# Altium schematic sheet USB-NORA-W1_SCHEM_02.SchDoc
size B; Date: 7/24/2020; CompanyName: U-blox; DrawnBy: ASOH/HEKF; Engineer: ASOH/HEKF; Organization: U-blox; Address1: Östra Varvsgatan 4; Address2: SE-211 75 Malmo; DocumentNumber: 2; Revision: A; SheetNumber: 2; SheetTotal: 3; SheetSize: B; SheetTitle: Interface MCU
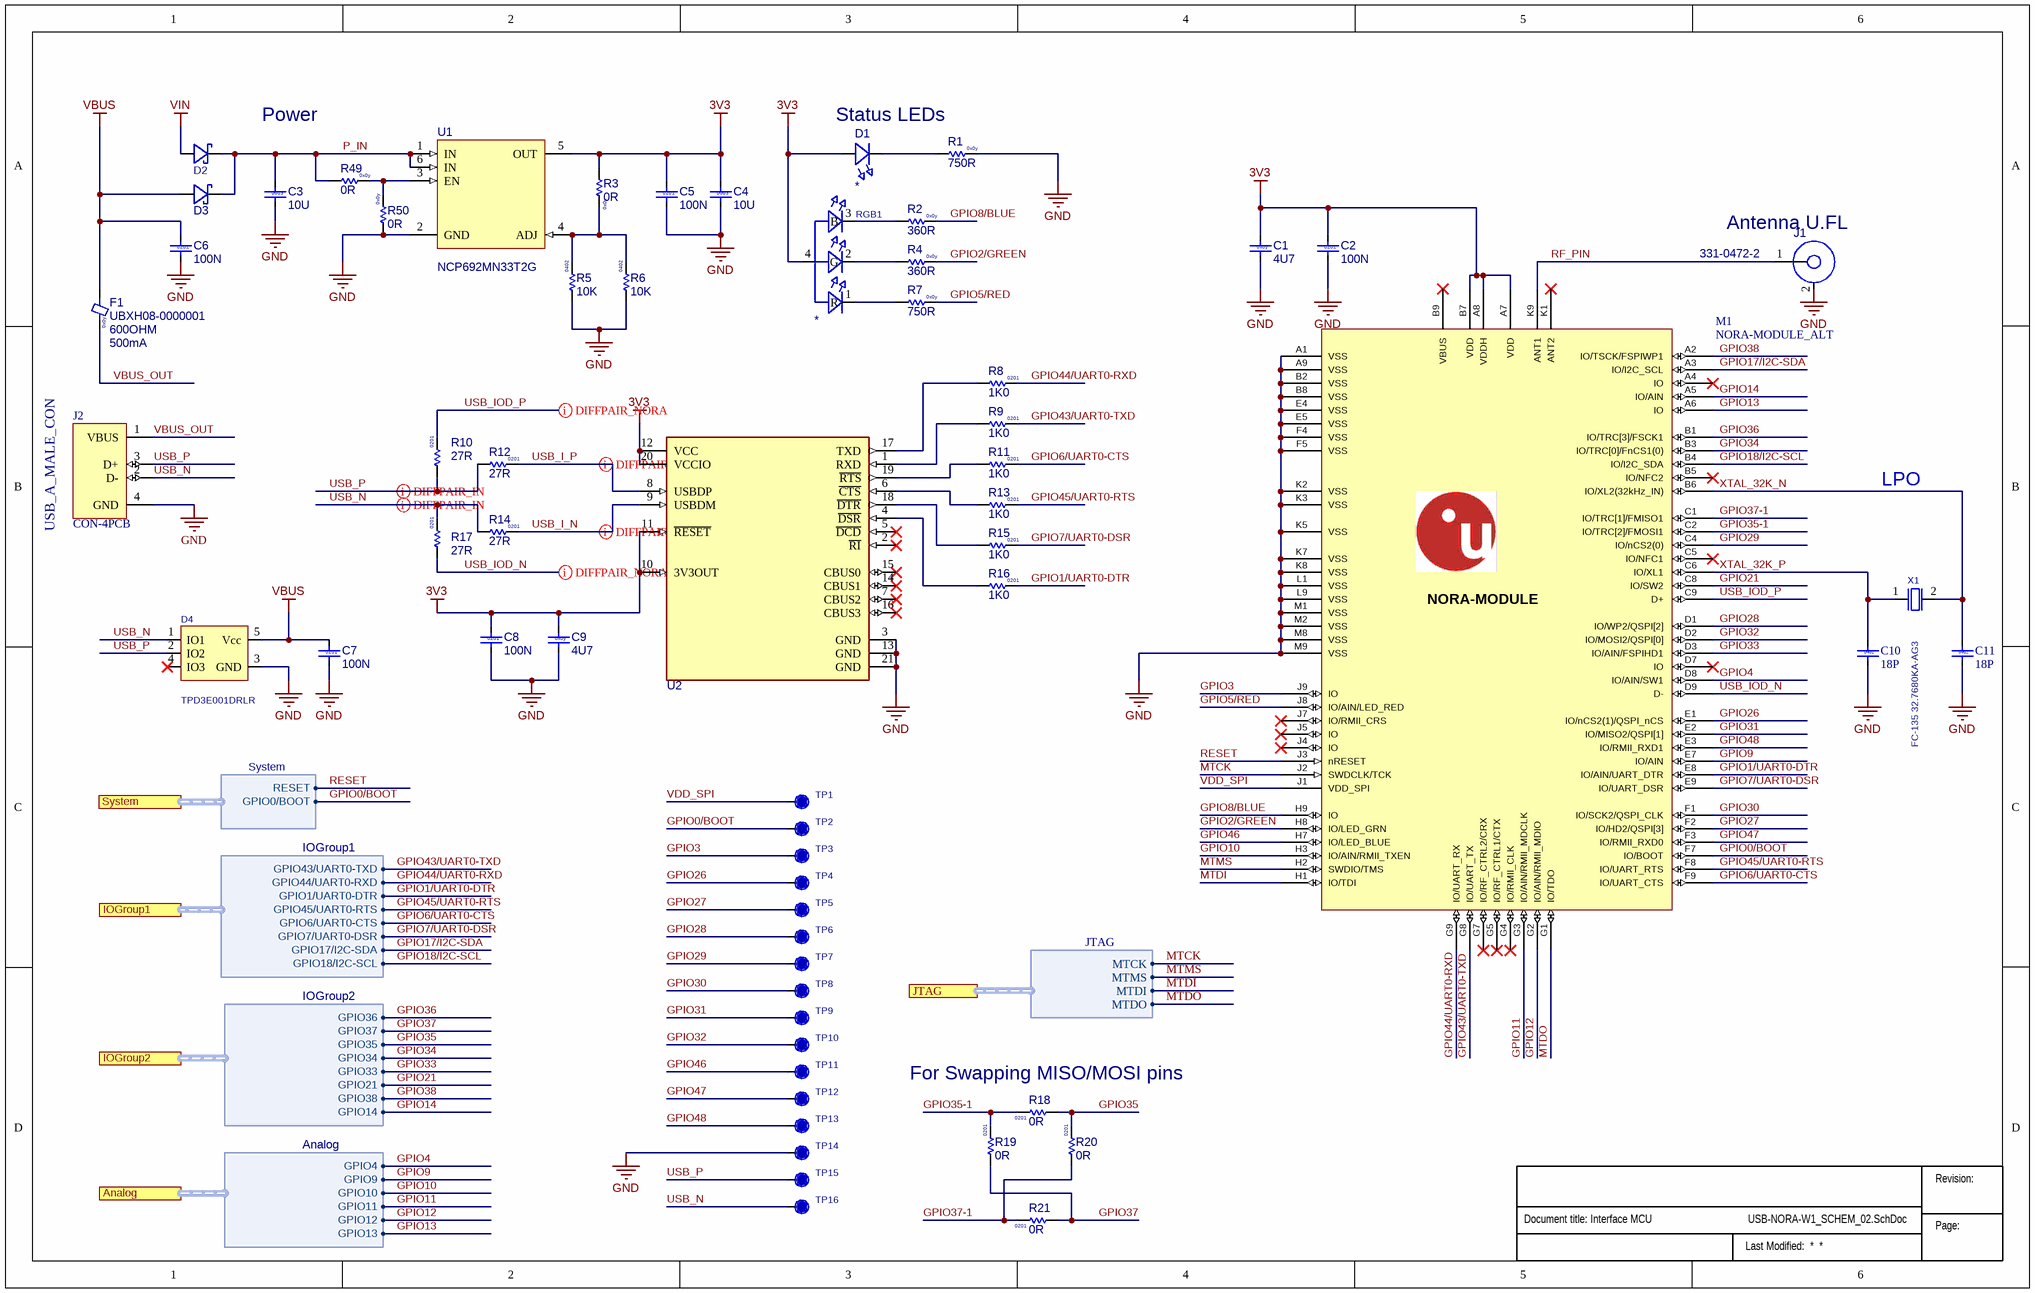
[diagram p0: USB-NORA-W1_SCHEM_02.SchDoc]

## Parts
?  (no value)  (graphical)
C1  value 4U7  Size: 0x0y  [Cap 0402 HD]
C2  value 100N  Size: 0201  [Cap 0201 HD]  (hidden comment: UBXH01-0000417100N)
C3  value 10U  Size: 0603  [Cap 0603 HD]
C4  value 10U  Size: 0603  [Cap 0603 HD]
C5  value 100N  Size: 0201  [Cap 0201 HD]
C6  value 100N  Size: 0201  [Cap 0201 HD]
C7  value 100N  Size: 0201  [Cap 0201 HD]
C8  value 100N  Size: 0201  [Cap 0201 HD]  (hidden comment: UBXH01-0000417100N)
C9  value 4U7  Size: 0x0y  [Cap 0402 HD]
C10  value 18P  Size: 0402  [Cap 0402]
C11  value 18P  Size: 0402  [Cap 0402]
D1  (no value)  [LED-0603]
D2  (no value)  [SOD-123F_U]
D3  (no value)  [SOD-123F_U]
D4  Manufacturer P/N: TPD3E001DRLR  [SOT-553]  (hidden comment: 110-00018)
F1  value 600OHM  Size: 0x0y  Part Number: UBXH08-0000001  Max Current: 500mA  [IND 0603 HD]
J1  Manufacturer P/N: 331-0472-2  [U.FL_3Pin]
J2  CON-4PCB  [USB-A-PCB]
M1  NORA-MODULE_ALT  [NORA_LGA82R_1430X1040X180_ANT]
R1  value 750R  Size: 0x0y  [RES 0402 HD]
R2  value 360R  Size: 0x0y  [RES 0402 HD]
R3  value 0R  Size: 0x0y  [RES 0402 HD]
R4  value 360R  Size: 0x0y  [RES 0402 HD]
R5  value 10K  Size: 0402  [RES 0402 HD]
R6  value 10K  Size: 0402  [RES 0402 HD]
R7  value 750R  Size: 0x0y  [RES 0402 HD]
R8  value 1K0  Size: 0201  [RES 0201 HD]
R9  value 1K0  Size: 0201  [RES 0201 HD]  (hidden comment: UBXH18-00080491K0)
R10  value 27R  Size: 0201  [RES 0201 HD]
R11  value 1K0  Size: 0201  [RES 0201 HD]  (hidden comment: UBXH18-00080491K0)
R12  value 27R  Size: 0201  [RES 0201 HD]
R13  value 1K0  Size: 0201  [RES 0201 HD]
R14  value 27R  Size: 0201  [RES 0201 HD]
R15  value 1K0  Size: 0201  [RES 0201 HD]
R16  value 1K0  Size: 0201  [RES 0201 HD]
R17  value 27R  Size: 0201  [RES 0201 HD]
R18  value 0R  Size: 0201  [RES 0201 HD]  (hidden comment: UBXH18-00030020R)
R19  value 0R  Size: 0201  [RES 0201 HD]  (hidden comment: UBXH18-00030020R)
R20  value 0R  Size: 0201  [RES 0201 HD]  (hidden comment: UBXH18-00030020R)
R21  value 0R  Size: 0201  [RES 0201 HD]  (hidden comment: UBXH18-00030020R)
R49  value 0R  Size: 0x0y  [RES 0402 HD]
R50  value 0R  Size: 0x0y  [RES 0402 HD]
RGB1  (no value)  [LED_1616]
TP1  TP  [TP10R]  (value not drawn)  (no BOM)
TP2  TP  [TP10R]  (value not drawn)  (no BOM)
TP3  TP  [TP10R]  (value not drawn)  (no BOM)
TP4  TP  [TP10R]  (value not drawn)  (no BOM)
TP5  TP  [TP10R]  (value not drawn)  (no BOM)
TP6  TP  [TP10R]  (value not drawn)  (no BOM)
TP7  TP  [TP10R]  (value not drawn)  (no BOM)
TP8  TP  [TP10R]  (value not drawn)  (no BOM)
TP9  TP  [TP10R]  (value not drawn)  (no BOM)
TP10  TP  [TP10R]  (value not drawn)  (no BOM)
TP11  TP  [TP10R]  (value not drawn)  (no BOM)
TP12  TP  [TP10R]  (value not drawn)  (no BOM)
TP13  TP  [TP10R]  (value not drawn)  (no BOM)
TP14  TP  [TP10R]  (value not drawn)  (no BOM)
TP15  TP  [TP10R]  (value not drawn)  (no BOM)
TP16  TP  [TP10R]  (value not drawn)  (no BOM)
U1  NCP692MN33T2G  [DFN-PSON.1P3X3-7pin_HS-7N]
U2  FT231XQ-R  [QFN_5x5_FT231XQ]  (value not drawn)
X1  Manufacturer P/N: FC-135 32.7680KA-AG3  [XTAL_3215]

## Ports
Analog (harness Analog, see USB-NORA-W1_TOP_01[3B], USB-NORA-W1_SCHEM_03[2B]), IOGroup1 (harness IOGroup1, see USB-NORA-W1_TOP_01[3B], USB-NORA-W1_SCHEM_03[2B]), IOGroup2 (harness IOGroup2, see USB-NORA-W1_TOP_01[3B], USB-NORA-W1_SCHEM_03[2A]), JTAG (harness JTAG, see USB-NORA-W1_TOP_01[3B], USB-NORA-W1_SCHEM_03[2A]), System (harness System, see USB-NORA-W1_TOP_01[3B], USB-NORA-W1_SCHEM_03[2C])

## Harnesses
IOGroup1: GPIO43/UART0-TXD, GPIO44/UART0-RXD, GPIO1/UART0-DTR, GPIO45/UART0-RTS, GPIO6/UART0-CTS, GPIO7/UART0-DSR, GPIO17/I2C-SDA, GPIO18/I2C-SCL
IOGroup2: GPIO36, GPIO37, GPIO35, GPIO34, GPIO33, GPIO21, GPIO38, GPIO14
Analog: GPIO4, GPIO9, GPIO10, GPIO11, GPIO12, GPIO13
System: RESET, GPIO0/BOOT
JTAG: MTCK, MTMS, MTDI, MTDO

## Nets
3V3: C1.1 C2.1 C4.1 C5.1 C8.1 C9.1 D1.2(A) M1.A7(VDD) M1.A8(VDDH) M1.B7(VDD) R3.1 RGB1.4(A) U1.5(OUT) U2.10(3V3OUT) U2.11(~{RESET}) U2.12(VCC) U2.20(VCCIO)
GND: C1.2 C2.2 C3.2 C4.2 C5.2 C6.2 C7.2 C8.2 C9.2 C10.2 C11.2 D4.3(GND) J1.2 J2.4(GND) M1.A1(VSS) M1.A9(VSS) M1.B2(VSS) M1.B8(VSS) M1.E4(VSS) M1.E5(VSS) M1.F4(VSS) M1.F5(VSS) M1.K2(VSS) M1.K3(VSS) M1.K5(VSS) M1.K7(VSS) M1.K8(VSS) M1.L1(VSS) M1.L9(VSS) M1.M1(VSS) M1.M2(VSS) M1.M8(VSS) M1.M9(VSS) R1.2 R5.1 R6.1 R50.1 TP14.1 U1.2(GND) U2.3(GND) U2.13(GND) U2.21(GND)
VBUS: C6.1 C7.1 D3.A(Anode) D4.5(Vcc) F1.1
VIN: D2.A(Anode)
GPIO0/BOOT: M1.F7(IO/BOOT) TP2.1 ; port System.GPIO0/BOOT
GPIO1/UART0-DTR: M1.E8(IO/AIN/UART_DTR) R16.2 ; port IOGroup1.GPIO1/UART0-DTR
GPIO2/GREEN: M1.H8(IO/LED_GRN) R4.2
GPIO3: M1.J9(IO) TP3.1
GPIO4: M1.D8(IO/AIN/SW1) ; port Analog.GPIO4
GPIO5/RED: M1.J8(IO/AIN/LED_RED) R7.2
GPIO6/UART0-CTS: M1.F9(IO/UART_CTS) R11.2 ; port IOGroup1.GPIO6/UART0-CTS
GPIO7/UART0-DSR: M1.E9(IO/UART_DSR) R15.2 ; port IOGroup1.GPIO7/UART0-DSR
GPIO8/BLUE: M1.H9(IO) R2.2
GPIO9: M1.E7(IO/AIN) ; port Analog.GPIO9
GPIO10: M1.H3(IO/AIN/RMII_TXEN) ; port Analog.GPIO10
GPIO11: M1.G3(IO/AIN/RMII_MDCLK) ; port Analog.GPIO11
GPIO12: M1.G2(IO/AIN/RMII_MDIO) ; port Analog.GPIO12
GPIO13: M1.A6(IO) ; port Analog.GPIO13
GPIO14: M1.A5(IO/AIN) ; port IOGroup2.GPIO14
GPIO17/I2C-SDA: M1.A3(IO/I2C_SCL) ; port IOGroup1.GPIO17/I2C-SDA
GPIO18/I2C-SCL: M1.B4(IO/I2C_SDA) ; port IOGroup1.GPIO18/I2C-SCL
GPIO21: M1.C8(IO/SW2) ; port IOGroup2.GPIO21
GPIO26: M1.E1(IO/nCS2(1)/QSPI_nCS) TP4.1
GPIO27: M1.F2(IO/HD2/QSPI[3]) TP5.1
GPIO28: M1.D1(IO/WP2/QSPI[2]) TP6.1
GPIO29: M1.C4(IO/nCS2(0)) TP7.1
GPIO30: M1.F1(IO/SCK2/QSPI_CLK) TP8.1
GPIO31: M1.E2(IO/MISO2/QSPI[1]) TP9.1
GPIO32: M1.D2(IO/MOSI2/QSPI[0]) TP10.1
GPIO33: M1.D3(IO/AIN/FSPIHD1) ; port IOGroup2.GPIO33
GPIO34: M1.B3(IO/TRC[0]/FnCS1(0)) ; port IOGroup2.GPIO34
GPIO35: R18.2 R20.2 ; port IOGroup2.GPIO35
GPIO35-1: M1.C2(IO/TRC[2]/FMOSI1) R18.1 R19.2
GPIO36: M1.B1(IO/TRC[3]/FSCK1) ; port IOGroup2.GPIO36
GPIO37: R19.1 R21.2 ; port IOGroup2.GPIO37
GPIO37-1: M1.C1(IO/TRC[1]/FMISO1) R20.1 R21.1
GPIO38: M1.A2(IO/TSCK/FSPIWP1) ; port IOGroup2.GPIO38
GPIO43/UART0-TXD: M1.G8(IO/UART_TX) R9.2 ; port IOGroup1.GPIO43/UART0-TXD
GPIO44/UART0-RXD: M1.G9(IO/UART_RX) R8.2 ; port IOGroup1.GPIO44/UART0-RXD
GPIO45/UART0-RTS: M1.F8(IO/UART_RTS) R13.2 ; port IOGroup1.GPIO45/UART0-RTS
GPIO46: M1.H7(IO/LED_BLUE) TP11.1
GPIO47: M1.F3(IO/RMII_RXD0) TP12.1
GPIO48: M1.E3(IO/RMII_RXD1) TP13.1
MTCK: M1.J2(SWDCLK/TCK) ; port JTAG.MTCK
MTDI: M1.H1(IO/TDI) ; port JTAG.MTDI
MTDO: M1.G1(IO/TDO) ; port JTAG.MTDO
MTMS: M1.H2(SWDIO/TMS) ; port JTAG.MTMS
P_IN: C3.1 D2.C(Cathode) D3.C(Cathode) R49.1 U1.1(IN) U1.6(IN)
RESET: M1.J3(nRESET) ; port System.RESET
RF_PIN: J1.1(ANT) M1.K9(ANT1)
USB_I_N: R14.2 U2.9(USBDM)
USB_I_P: R12.2 U2.8(USBDP)
USB_IOD_N: M1.D9(D-) R17.1
USB_IOD_P: M1.C9(D+) R10.2
USB_N: D4.1(IO1) J2.2(D-) R14.1 R17.2 TP16.1
USB_P: D4.2(IO2) J2.3(D+) R10.1 R12.1 TP15.1
VBUS_OUT: F1.2 J2.1(VBUS)
VDD_SPI: M1.J1(VDD_SPI) TP1.1
XTAL_32K_N: C11.1 M1.B6(IO/XL2(32kHz_IN)) X1.2
XTAL_32K_P: C10.1 M1.C6(IO/XL1) X1.1
NetD1_1: D1.1(C) R1.1
NetR2_1: R2.1 RGB1.3(B)
NetR3_2: R3.2 R5.2 R6.2 U1.4(ADJ)
NetR4_1: R4.1 RGB1.2(G)
NetR7_1: R7.1 RGB1.1(R)
NetR8_1: R8.1 U2.17(TXD)
NetR9_1: R9.1 U2.1(RXD)
NetR11_1: R11.1 U2.19(~{RTS})
NetR13_1: R13.1 U2.6(~{CTS})
NetR15_1: R15.1 U2.18(~{DTR})
NetR16_1: R16.1 U2.4(~{DSR})
NetR49_2: R49.2 R50.2 U1.3(EN)

Not connected (* = marked no-connect by the designer): D4 4(IO3)*; M1 A4(IO)* B5(IO/NFC2)* B9(VBUS)* C5(IO/NFC1)* D7(IO)* G4(IO/RMII_CLK)* G5(IO/RF_CTRL1/CTX)* G7(IO/RF_CTRL2/CRX)* J4(IO)* J5(IO)* J7(IO/RMII_CRS)* K1(ANT2)*; U2 2(~{RI})* 5(~{DCD})* 7(CBUS2)* 14(CBUS1)* 15(CBUS0)* 16(CBUS3)*

## Layout directives
differential pair; net class DIFF100: USB_I_N, USB_I_P, USB_IOD_N, USB_IOD_P, USB_N, USB_P

## Notes on the sheet
- Power
- Status LEDs
- (near J1) Antenna U.FL
- LPO
- USB_A_MALE_CON
- (near R18) For Swapping MISO/MOSI pins
- Revision:
- Page:
- (in symbol NORA-MODULE_ALT) NORA-MODULE

## Library data of the parts
? = Sub_Title_Block: Minimized schematic title block for all subset sheets
C1 C9 = UBXH01-0000243: CAP CER X5R 0402; Manufacturer: Murata Manufacturing Company, Ltd.; Manufacturer P/N: GRM155R61A475MEAA; Tolerance: 20%; Max Voltage: 10.0V; Editor: dario.antonaz; Released by: pasquale.scorca; Env: ROHS; Permitted Use: Volume Products; Perferred: PREF; Mfg P/N Status: Active; Mfg P/N Split: 100; Mfg P/N Released: Yes; Part Number: UBXH01-0000243; Min Operating Temp: -40°C; Max Operating Temp: 85°C; Part Type: Capacitor; Release Data: 2016-03-17 10:02:21.014314; UBX Wiki: https://wiki.u-blox.com/bin/view/Operations/PartDetails?index=24303; RefDes: C; Mfg P/N Datasheet: https://wiki.u-blox.com/bin/view/Generic/Docs/DocumentSummary?index=24302
C2 C5-C8 = UBXH01-0000245: CAP CER X5R 0201 100N 10% 10V; Manufacturer: Murata Manufacturing Company, Ltd.; Manufacturer P/N: GRM033R61A104KE84; Editor: dario.antonaz; Released by: jure.podmenik; Env: ROHS; Permitted Use: Volume Products; Perferred: PREF; Mfg P/N Status: Active; Mfg P/N Split: 0; Mfg P/N Released: Yes; Part Number: UBXH01-0000245; Tolerance: 10%; Max Voltage: 10V; Min Operating Temp: -40°C; Max Operating Temp: 85°C; Part Type: Capacitor; Release Data: 2016-03-11 16:09:03.879257; UBX Wiki: https://wiki.u-blox.com/bin/view/Operations/PartDetails?index=24347; RefDes: C; Mfg P/N Datasheet: https://wiki.u-blox.com/bin/view/Generic/Docs/DocumentSummary?index=24348; Manufacturer 2: Taiyo Yuden Company, Ltd.; Manufacturer P/N 2: LMK063BJ104KP-F; Mfg P/N Status 2: Active; Mfg P/N Split 2: 0; Mfg P/N Released 2: Yes; Mfg P/N Datasheet 2: https://wiki.u-blox.com/bin/view/Generic/Docs/DocumentSummary?index=27440; Manufacturer 3: Samsung Electro-Mechanics; Manufacturer P/N 3: CL03A104KA3NNN; Mfg P/N Status 3: Active; Mfg P/N Split 3: 0; Mfg P/N Released 3: Yes; Mfg P/N Datasheet 3: https://wiki.u-blox.com/bin/view/Generic/Docs/DocumentSummary?index=28183
C3 C4 = UBXH01-0000040: CAP CER X5R 0603 10U 20% 10V; Manufacturer: Taiyo Yuden Company, Ltd.; Manufacturer P/N: LMK107BBJ106MALT; Editor: pierpaolo.arban; Released by: matej.budin; Env: ROHS; Permitted Use: Volume Products; Perferred: PREF; Mfg P/N Status: Active; Mfg P/N Split: 100; Mfg P/N Released: Yes; Part Number: UBXH01-0000040; Tolerance: 20%; Max Voltage: 10V; Part Type: Capacitor; Release Data: 2013-01-10 11:54:39.678233; UBX Wiki: https://wiki.u-blox.com/bin/view/Operations/PartDetails?index=16909; RefDes: C; Mfg P/N Datasheet: https://wiki.u-blox.com/bin/view/Generic/Docs/DocumentSummary?index=16905; Manufacturer 2: Murata Manufacturing Company, Ltd.; Manufacturer P/N 2: GRM188R61A106KAAL; Mfg P/N Status 2: Active; Mfg P/N Split 2: 0; Mfg P/N Released 2: Yes; Mfg P/N Datasheet 2: https://wiki.u-blox.com/bin/view/Generic/Docs/DocumentSummary?index=27232; Manufacturer 3: Taiyo Yuden Company, Ltd.; Manufacturer P/N 3: LMK107BJ106MALTD; Mfg P/N Status 3: NRND; Mfg P/N Split 3: 0; Mfg P/N Released 3: Yes; Mfg P/N Datasheet 3: https://wiki.u-blox.com/bin/view/Generic/Docs/DocumentSummary?index=29392
C10 C11 = UBXH01-0004017: CAP CER C0G 0402 18P 5% 25V; Manufacturer: Murata Manufacturing Company, Ltd.; Manufacturer P/N: GRM1555C1H180JA01; Editor: doris.zahnd; Released by: daniel.hurni; Env: ROHS; Permitted Use: Volume Products; Perferred: PREF; Mfg P/N Status: NRND; Mfg P/N Split: 100; Mfg P/N Released: Yes; Part Number: UBXH01-0004017; Tolerance: 5%; Max Voltage: 25V; Min Operating Temp: -55°C; Max Operating Temp: 125°C; Part Type: Capacitor; Release Data: 2009-12-03 17:48:42.813059; UBX Wiki: https://wiki.u-blox.com/bin/view/Operations/PartDetails?index=5178; RefDes: C; Manufacturer 2: Murata Manufacturing Company, Ltd.; Manufacturer P/N 2: GRM1555C1E180JZ01; Mfg P/N Status 2: Obsolete; Mfg P/N Split 2: 0; Mfg P/N Released 2: Yes; Manufacturer 3: Murata Manufacturing Company, Ltd.; Manufacturer P/N 3: GRM1555C1H180JZ01; Mfg P/N Status 3: Obsolete; Mfg P/N Split 3: 0; Mfg P/N Released 3: Yes
D1 = UBXH11-0000018: LED CHIP 0603 LOW CURRENT OSRAM 0.002A; Manufacturer P/N: LG L29K-G2J1-24; Value: GREEN; Max Voltage: 2.2V; Max Current: 2mA; Editor: johann.furrer; Released by: martin.grasse; Env: ROHS; Permitted Use: Volume Products; Perferred: PREF; Mfg P/N Status: Active; Mfg P/N Split: 100; Mfg P/N Released: Yes; Color: *; Part Number: UBXH11-0000018; Min Operating Temp: -40°C; Max Operating Temp: 85°C; Part Type: LED; Release Data: 2018-01-09 15:31:38.754561; UBX Wiki: https://wiki.u-blox.com/bin/view/Operations/PartDetails?index=20619; RefDes: DS; Manufacturer: Osram; Mfg P/N Datasheet: https://wiki.u-blox.com/bin/view/Generic/Docs/DocumentSummary?index=20620
D2 D3 = 110-00005: Diode, Schottky, 20V 1A SOD-123F, 340mV Vf @ 1A / MBR120VLSFT3G; Manufacturer 1: ON Semiconductor; Part Name: Diode Schottky 20V 1A SOD-123FL; Body Size: None; Item Phase: In Production; MFG Package: SOD-123FL; Use in new designs: Yes; Part Number: 110-00005; Manufacturer Part Number 1: MBR120VLSFT3G; Supplier 1: Digi-Key; Supplier Part Number 1: MBR120VLSFT3GOSCT-ND; Manufacturer 2: None; Manufacturer Part Number 2: None; Supplier 2: None; Supplier Part Number 2: None; Current: 1A; Height: 0.98mm; Max Operating Temp: 125; Min Operating Temp: -65; Pins: 2; Revision: 0B; Voltage: 20V; UBX Code: None
D4 = 110-00018: LOW-CAPACITANCE 3-CHANNEL ESD-PROTECTION ARRAY; Part Name: TVS Diode, 3CH High Speed ESD; Part_Type: Diode; Manufacturer: Texas Instruments; Item_Phase: Production; Body Size: 1.6mm x 1.2mm; Component Mounting Type: SMT; Diode Type: TVS; Use in new designs: Yes; Voltage: 5V; Part Number: 110-00018; Revision: 0A; Supplier 1: Digi-Key; Supplier Part Number 1: 296-21885-1-ND; Arena Link: https://app.bom.com/a/UCV39GZGZIHX50AE?v=spec.summary; Height: .55mm; MFG Package: SOT-553; Package Type: SOT; Pins: 5
F1 = UBXH08-0000001: FERRITE BEAD, 0603, 600 OHM AT 100MHZ; Manufacturer: TDK Corporation; Manufacturer P/N: MMZ1608B601C; Editor: daniel.hurni; Released by: martin.frauchiger; Env: ROHS; Permitted Use: Support Products; Perferred: PREF; Mfg P/N Status: Active; Mfg P/N Split: 100; Mfg P/N Released: Yes; Min Operating Temp: -40°C; Max Operating Temp: 125°C; Part Type: Ferrite; Release Data: 2009-12-02 10:18:36.177919; UBX Wiki: https://wiki.u-blox.com/bin/view/Operations/PartDetails?index=7960; RefDes: FB; Mfg P/N Datasheet: https://wiki.u-blox.com/bin/view/Generic/Docs/DocumentSummary?index=7941
J1 = UBXH04-0001026: CONN HIROSE U.FL SERIES STRAIGHT RECEPTACLE; Value: 331-0472-2; Editor: roland.rust; Env: ROHS; Permitted Use: Support Products; Perferred: PREF; Mfg P/N Status: Obsolete; Mfg P/N Split: 0; Mfg P/N Released: Yes; Part Number: UBXH04-0001026; Manufacturer: Hirose; Part Type: Connector; Released by: roland.rust; Release Data: 2007-09-18 11:03:31; UBX Wiki: https://wiki.u-blox.com/bin/view/Operations/PartDetails?index=5854; RefDes: J
J2 = UBXH04-0000711: CONN USB PLUG A TYPE PCB FOOTPRINT; Editor: aneeb.sohail; Env: ROHS; Permitted Use: Support Products; Part Number: UBXH04-0000711; Part Type: Connector; UBX Wiki: https://wiki.u-blox.com/bin/view/Operations/PartDetails?index=35472; Perferred: N/A; RefDes: J
M1 = NORA-MODULE_ALT: u-blox NORA module generic symbol for use within module designs - alternate version; Part Description: NORA MODULE FOOTPRINT; Body Size: 14.3 mm x 10.4 mm; Manufacturer P/N: NORA; Part Number: NORA; Part Name: NORA; Part_Type: Module; Manufacturer: u-blox; Height: 0; Value: NORA
R1 R7 = UBXH18-0008046: RES THICK FILM CHIP 0402; Manufacturer: Panasonic; Manufacturer P/N: ERJ2GEJ751X; Tolerance: 5%; Max Power: 100mW; Editor: jaka.bevk; Released by: erian.bezhani; Env: ROHS; Permitted Use: Volume Products; Perferred: PREF; Mfg P/N Status: Active; Mfg P/N Split: 100; Mfg P/N Released: Yes; Part Number: UBXH18-0008046; Part Type: Resistor; Release Data: 2014-10-03 09:31:33.687559; UBX Wiki: https://wiki.u-blox.com/bin/view/Operations/PartDetails?index=6935; RefDes: R; Mfg P/N Datasheet: https://wiki.u-blox.com/bin/view/Generic/Docs/DocumentSummary?index=21267
R2 R4 = UBXH18-0000216: RES THICK FILM CHIP 0402; Manufacturer: KOA; Manufacturer P/N: RK73H1ETTP3600F; Tolerance: 1%; Max Power: 63mW; Editor: michael.hein; Released by: vasyl.dykyy; Env: ROHS; Permitted Use: Volume Products; Perferred: PREF; Mfg P/N Status: Active; Mfg P/N Split: 100; Mfg P/N Released: Yes; Part Number: UBXH18-0000216; Part Type: Resistor; Release Data: 2015-10-02 11:55:45.476057; Automotive: Yes; UBX Wiki: https://wiki.u-blox.com/bin/view/Operations/PartDetails?index=23306; RefDes: R; Mfg P/N Datasheet: https://wiki.u-blox.com/bin/view/Generic/Docs/DocumentSummary?index=8222
R3 R49 R50 = UBXH18-0003002: RES THICK FILM CHIP 0402; Manufacturer: YAGEO; Manufacturer P/N: 2322_705_91001_L; Tolerance: 0; Max Power: 100mW; Editor: charlotte.biber; Released by: peter.mueller; Env: ROHS; Permitted Use: Volume Products; Perferred: PREF; Mfg P/N Status: NRND; Mfg P/N Released: Yes; Part Number: UBXH18-0003002; Part Type: Resistor; Release Data: 2012-06-05 09:49:55.978616; UBX Wiki: https://wiki.u-blox.com/bin/view/Operations/PartDetails?index=6611; RefDes: R; Mfg P/N Split: 0
R5 R6 = UBXH18-0008073: RES THICK FILM CHIP 0402 10K 5% 100mW; Manufacturer: YAGEO; Manufacturer P/N: 2322_705_87103_L; Editor: martin.frauchiger; Env: ROHS; Permitted Use: Volume Products; Perferred: PREF; Mfg P/N Status: NRND; Mfg P/N Split: 0; Mfg P/N Released: Yes; Part Number: UBXH18-0008073; Tolerance: 5%; Max Power: 100mW; Part Type: Resistor; Released by: martin.frauchiger; Release Data: 2005-08-19 10:42:45; UBX Wiki: https://wiki.u-blox.com/bin/view/Operations/PartDetails?index=6981; RefDes: R
R8 R9 R11 R13 R15 R16 = UBXH18-0000007: RES THICK FILM CHIP 0201 1K0 5% 50mW; Manufacturer: KOA; Manufacturer P/N: RK73B1HTTC102J; Editor: martin.pilik; Released by: fabrice.bret-dibat; Env: GREEN; Permitted Use: Volume Products; Perferred: PREF; Mfg P/N Status: Active; Mfg P/N Split: 100; Mfg P/N Released: Yes; Part Number: UBXH18-0000007; Tolerance: 5%; Max Power: 50mW; Part Type: Resistor; Release Data: 2021-05-10 13:01:52.556503; UBX Wiki: https://wiki.u-blox.com/bin/view/Operations/PartDetails?index=8216; RefDes: R; Mfg P/N Datasheet: https://wiki.u-blox.com/bin/view/Generic/Docs/DocumentSummary?index=4543; Manufacturer 2: Panasonic; Manufacturer P/N 2: ERJ-1GNJ102C; Mfg P/N Status 2: Active; Mfg P/N Split 2: 0; Mfg P/N Released 2: No; Mfg P/N Datasheet 2: https://wiki.u-blox.com/bin/view/Generic/Docs/DocumentSummary?index=35141; Manufacturer 3: YAGEO; Manufacturer P/N 3: RC0201JR-071KL; Mfg P/N Status 3: Active; Mfg P/N Split 3: 0; Mfg P/N Released 3: Yes; Mfg P/N Datasheet 3: https://wiki.u-blox.com/bin/view/Generic/Docs/DocumentSummary?index=26941
R10 R12 R14 R17 = UBXH18-0000470: RES THICK FILM CHIP 0201 27R 5% 50mW; Manufacturer: Samsung Electro-Mechanics; Manufacturer P/N: RC0603J270CS; Editor: alex.claville; Released by: andre.pick; Env: ROHS; Permitted Use: Volume Products; Mfg P/N Status: NRND; Mfg P/N Split: 100; Mfg P/N Released: Yes; Part Number: UBXH18-0000470; Tolerance: 5%; Max Power: 50mW; Min Operating Temp: -55°C; Max Operating Temp: 125°C; Part Type: Resistor; Release Data: 2019-05-22 14:26:44.225770; UBX Wiki: https://wiki.u-blox.com/bin/view/Operations/PartDetails?index=30167; Perferred: N/A; RefDes: R; Manufacturer 2: YAGEO; Manufacturer P/N 2: RC0201JR-0727RL; Mfg P/N Status 2: Active; Mfg P/N Split 2: 0; Mfg P/N Released 2: Yes
R18-R21 = UBXH18-0003003: RES THICK FILM CHIP 0201 0R 0 500mA; Manufacturer: KOA; Manufacturer P/N: RK73Z1HTTC; Tolerance: 0; Editor: martin.pilik; Released by: fabrice.bret-dibat; Env: GREEN; Permitted Use: Volume Products; Perferred: PREF; Mfg P/N Status: Active; Mfg P/N Split: 100; Mfg P/N Released: Yes; Part Number: UBXH18-0003003; Max Current: 500mA; Part Type: Resistor; Release Data: 2021-06-24 13:59:00.147333; UBX Wiki: https://wiki.u-blox.com/bin/view/Operations/PartDetails?index=6614; RefDes: R; Mfg P/N Datasheet: https://wiki.u-blox.com/bin/view/Generic/Docs/DocumentSummary?index=8616; Manufacturer 2: Samsung Electro-Mechanics; Manufacturer P/N 2: RC0603J000CS; Mfg P/N Status 2: NRND; Mfg P/N Split 2: 0; Mfg P/N Released 2: Yes; Mfg P/N Datasheet 2: https://wiki.u-blox.com/bin/view/Generic/Docs/DocumentSummary?index=20205
RGB1 = 115-00026: LED RGB SMT 0606; Manufacturer 1: Lite-On Inc; Manufacturer Part Number 1: LTST-C19HE1WT; Body Size: 1.6mm x 1.6mm; Current: 20mA; Item Phase: In Production; MFG Package: 0606; Use in new designs: Yes; Voltage: None; Color: *; Part Number: 115-00026; Supplier 1: Digi-Key; Supplier Part Number 1: 160-2162-1-ND; Height: 0.35mm; Max Operating Temp: 80; Min Operating Temp: -20; Part Name: LED RGB SMT 0606; Pins: 4; Revision: 0B; Size: Other; UBX Code: None; Supplier 2: Digi-Key; Supplier Part Number 2: 1516-1184-1-ND
TP1-TP16 = TP10R: Testpoint, Round 1.0mm Dia; Added By: Jeremy D; Part Number: TP10R; Size: 1.0mm; Height: 0; DNP: DNP; Added Date: 2/1/2015; Checked By: Paul B; Checked Date: 2/5/2015
U1 = UBXH12-0000459: LOW DROPOUT REGULATOR ON SEMICONDUCTOR NCP692MN33T2G 6DFN 3.3V 6V 1A; Editor: hakan.ekfors; Released by: markus.wejrot; Env: ROHS; Permitted Use: Volume Products; Perferred: PREF; Mfg P/N Status: Active; Mfg P/N Split: 100; Mfg P/N Released: Yes; Part Number: UBXH12-0000459; Value: 3.3V; Max Voltage: 6V; Max Current: 1A; Min Operating Temp: -40°C; Max Operating Temp: 125°C; Part Type: Regulator; Release Data: 2021-08-23 15:14:48.502500; UBX Wiki: https://wiki.u-blox.com/bin/view/Operations/PartDetails?index=35423; RefDes: U; Manufacturer: ON Semiconductor; Manufacturer P/N: NCP692MN33T2G; Mfg P/N Datasheet: https://wiki.u-blox.com/bin/view/Generic/Docs/DocumentSummary?index=35425
U2 = UBXH10-0000054: FTDI USB TO SERIAL FULL UART INTERFACE QFN20; Manufacturer: FTDI Future Technology Devices International; Editor: adam.johansson; Env: ROHS; Permitted Use: Support Products; Perferred: PREF; Mfg P/N Status: Active; Mfg P/N Split: 100; Mfg P/N Released: No; Part Number: UBXH10-0000054; Value: FT231XQ-R; Min Operating Temp: -40°C; Max Operating Temp: 85°C; Part Type: Interface; UBX Wiki: https://wiki.u-blox.com/bin/view/Operations/PartDetails?index=27258; RefDes: U; Manufacturer P/N: FT231XQ-R; Mfg P/N Datasheet: https://wiki.u-blox.com/bin/view/Generic/Docs/DocumentSummary?index=33707
X1 = 100-00005: XTAL, 2Pin, 32.768kHz, 7pF 20ppm; Part Name: XTAL 32.768kHz 7pF 20ppm 3215; Part_Type: Crystal/Oscillator; Manufacturer: Epson; Item_Phase: Production; Body Size: 3.2mm x 1.5mm; Component Mounting Type: SMT; MFG Package: 2-SMD; Use in new designs: Yes; Part Number: 100-00005; Revision: 0C; Supplier 1: Digi-Key; Supplier Part Number 1: SER4086CT-ND; Manufacturer 2: AVX Corporation; Manufacturer P/N 2: ST3215SB32768C0HPWBB; Supplier 2: Digi-Key; Supplier Part Number 2: 1253-1113-1-ND; Arena Link: https://app.bom.com/a/L3MU07Q7Q98O5PC8?v=spec.summary; CL: 7pF; Frequency: 32.768kHz; Frequency Tolerance: 20ppm; Height: 0.9mm; Pins: 2